# EAGLE design Attenuator (EAGLE 9.2.2)

## Sheet 1 of 4: Power
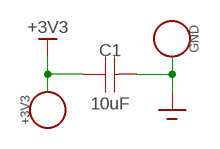
[diagram p0: schematic, sheet 1]

### Parts
C1  10uF  CAPACITOR0805  [0805]
TP1  +3V3  ALIGATOR-PAD  [ALIGATOR-PAD]
TP2  GND  ALIGATOR-PAD  [ALIGATOR-PAD]

### Nets
+3V3: C1.P$1 TP1.P$1 TP1.P$2 TP1.P$3 TP1.P$4 TP1.P$5 TP1.P$6 ; also sheet 2,3,4
GND: C1.P$2 TP2.P$1 TP2.P$2 TP2.P$3 TP2.P$4 TP2.P$5 TP2.P$6 ; also sheet 2,3,4

## Sheet 2 of 4: RF
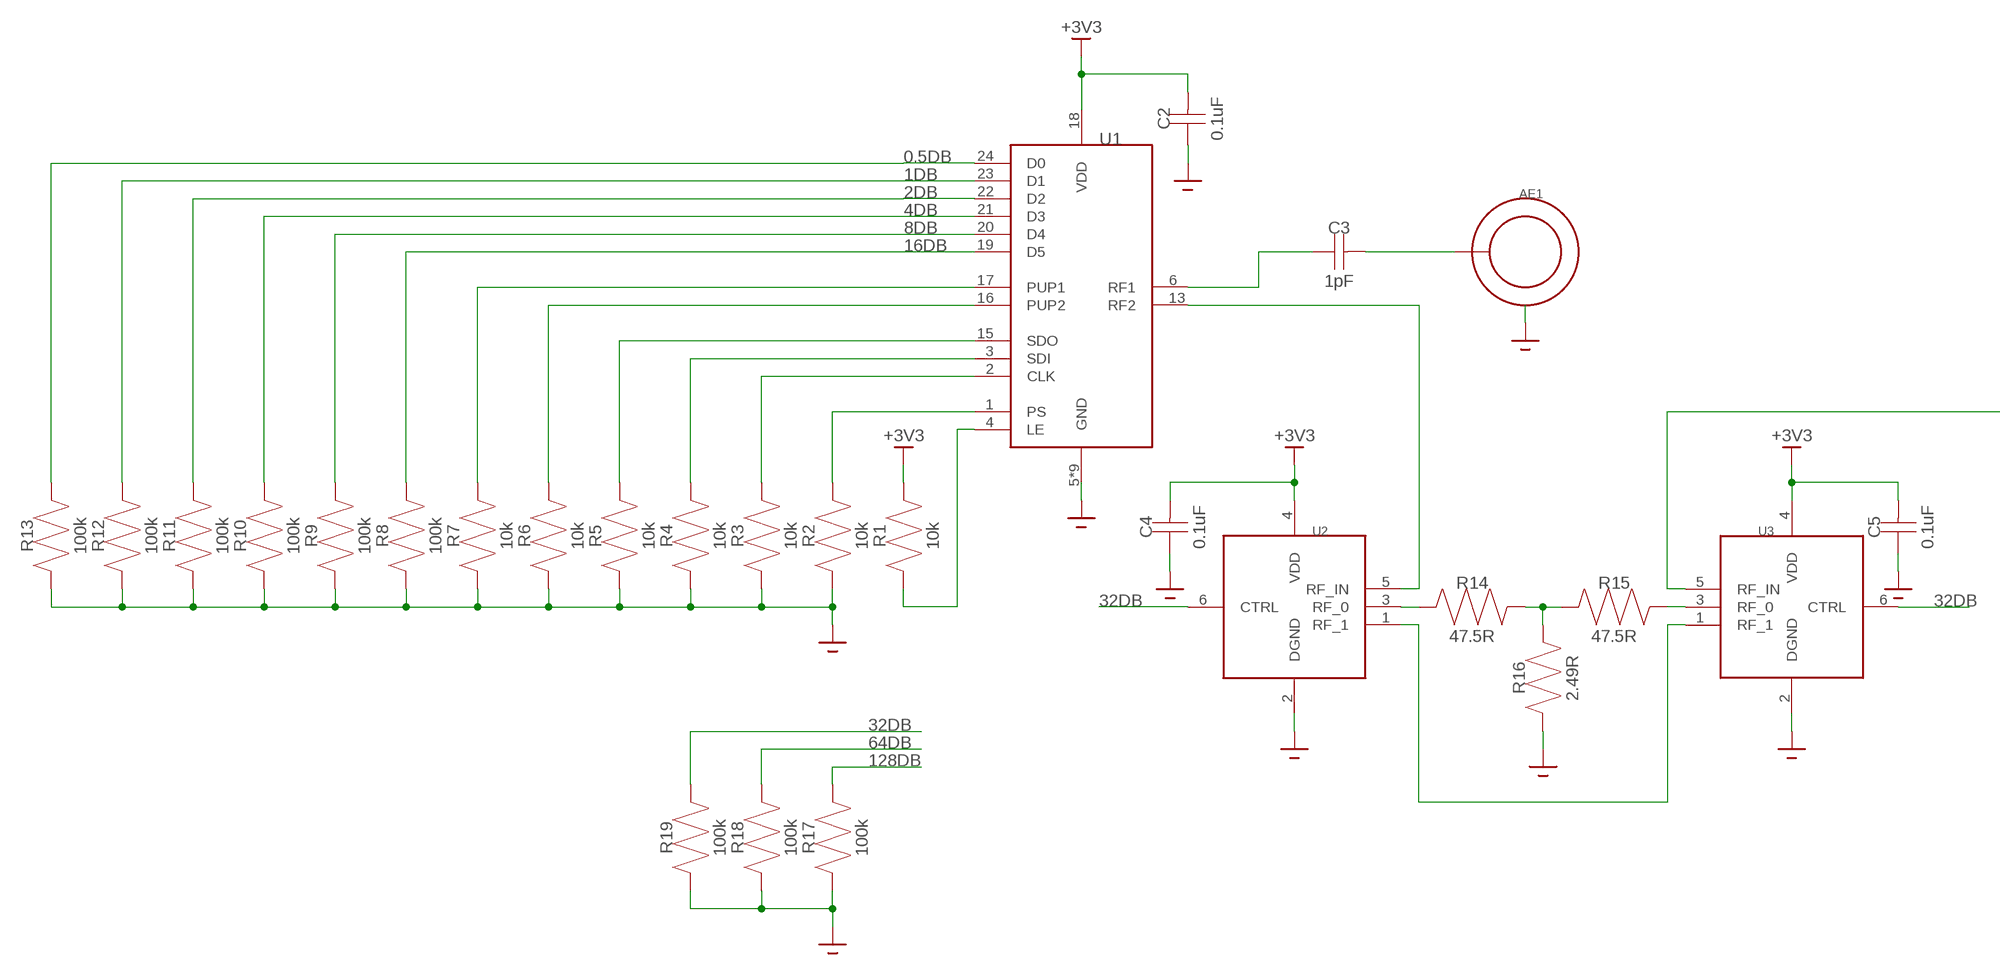
[diagram p1: schematic, sheet 2, part 1 of 2]
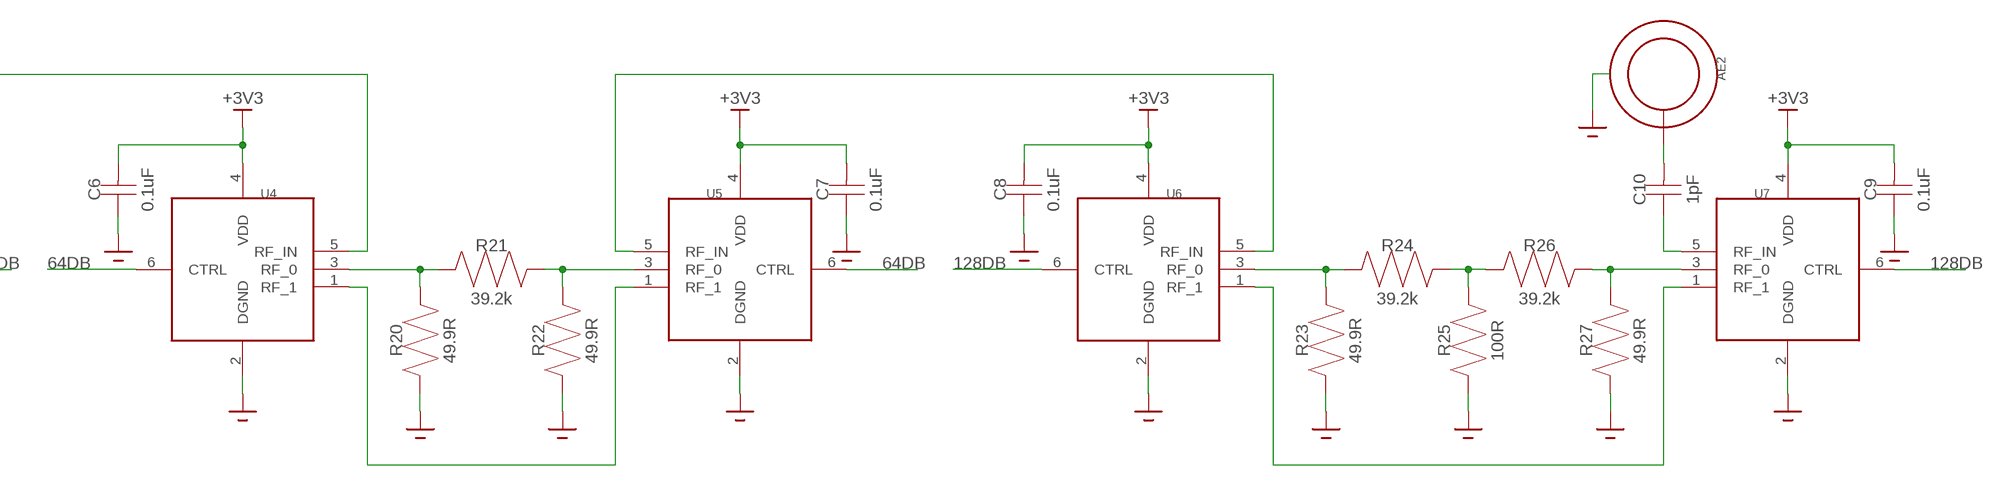
[diagram p2: schematic, sheet 2, part 2 of 2]

### Parts
AE1  CON-SMA-EDGE-S  [CON-SMA-EDGE-S]
AE2  CON-SMA-EDGE-S  [CON-SMA-EDGE-S]
C2  0.1uF  CAPACITOR0805  [0805]
C3  1pF  CAPACITOR0805  [0805]
C4  0.1uF  CAPACITOR0805  [0805]
C5  0.1uF  CAPACITOR0805  [0805]
C6  0.1uF  CAPACITOR0805  [0805]
C7  0.1uF  CAPACITOR0805  [0805]
C8  0.1uF  CAPACITOR0805  [0805]
C9  0.1uF  CAPACITOR0805  [0805]
C10  1pF  CAPACITOR0805  [0805]
R1  10k  RESISTOR0805  [0805]
R2  10k  RESISTOR0805  [0805]
R3  10k  RESISTOR0805  [0805]
R4  10k  RESISTOR0805  [0805]
R5  10k  RESISTOR0805  [0805]
R6  10k  RESISTOR0805  [0805]
R7  10k  RESISTOR0805  [0805]
R8  100k  RESISTOR0805  [0805]
R9  100k  RESISTOR0805  [0805]
R10  100k  RESISTOR0805  [0805]
R11  100k  RESISTOR0805  [0805]
R12  100k  RESISTOR0805  [0805]
R13  100k  RESISTOR0805  [0805]
R14  47.5R  RESISTOR0805  [0805]
R15  47.5R  RESISTOR0805  [0805]
R16  2.49R  RESISTOR0805  [0805]
R17  100k  RESISTOR0805  [0805]
R18  100k  RESISTOR0805  [0805]
R19  100k  RESISTOR0805  [0805]
R20  49.9R  RESISTOR0805  [0805]
R21  39.2k  RESISTOR0805  [0805]
R22  49.9R  RESISTOR0805  [0805]
R23  49.9R  RESISTOR0805  [0805]
R24  39.2k  RESISTOR0805  [0805]
R25  100R  RESISTOR0805  [0805]
R26  39.2k  RESISTOR0805  [0805]
R27  49.9R  RESISTOR0805  [0805]
U1  SKY12347-362LF  [QFN50P400X400X100-25T270N]
U2  BGS12SN6E6327XTSA1  [SON40P70X110X40-6N]
U3  BGS12SN6E6327XTSA1  [SON40P70X110X40-6N]
U4  BGS12SN6E6327XTSA1  [SON40P70X110X40-6N]
U5  BGS12SN6E6327XTSA1  [SON40P70X110X40-6N]
U6  BGS12SN6E6327XTSA1  [SON40P70X110X40-6N]
U7  BGS12SN6E6327XTSA1  [SON40P70X110X40-6N]

### Nets
0.5DB: R13.P$2 U1.24(D0) ; also sheet 3,4
1DB: R12.P$2 U1.23(D1) ; also sheet 3,4
2DB: R11.P$2 U1.22(D2) ; also sheet 3,4
4DB: R10.P$2 U1.21(D3) ; also sheet 3,4
8DB: R9.P$2 U1.20(D4) ; also sheet 3,4
16DB: R8.P$2 U1.19(D5) ; also sheet 3,4
32DB: R19.P$2 U2.6(CTRL) U3.6(CTRL) ; also sheet 3,4
64DB: R18.P$2 U4.6(CTRL) U5.6(CTRL) ; also sheet 3,4
128DB: R17.P$2 U6.6(CTRL) U7.6(CTRL) ; also sheet 3,4
+3V3: C2.P$2 C4.P$2 C5.P$2 C6.P$2 C7.P$2 C8.P$2 C9.P$2 R1.P$2 U1.18(VDD) U2.4(VDD) U3.4(VDD) U4.4(VDD) U5.4(VDD) U6.4(VDD) U7.4(VDD) ; also sheet 1,3,4
GND: AE1.GND1(GND) AE1.GND2(GND) AE1.GND3(GND) AE1.GND4(GND) AE2.GND1(GND) AE2.GND2(GND) AE2.GND3(GND) AE2.GND4(GND) C2.P$1 C4.P$1 C5.P$1 C6.P$1 C7.P$1 C8.P$1 C9.P$1 R2.P$1 R3.P$1 R4.P$1 R5.P$1 R6.P$1 R7.P$1 R8.P$1 R9.P$1 R10.P$1 R11.P$1 R12.P$1 R13.P$1 R16.P$1 R17.P$1 R18.P$1 R19.P$1 R20.P$1 R22.P$1 R23.P$1 R25.P$1 R27.P$1 U1.5(GND) U1.7(GND) U1.8(GND) U1.9(GND) U1.10(GND) U1.11(GND) U1.12(GND) U1.14(GND) U1.25(GND) U2.2(DGND) U3.2(DGND) U4.2(DGND) U5.2(DGND) U6.2(DGND) U7.2(DGND) ; also sheet 1,3,4
N$1: C3.P$1 U1.6(RF1)
N$2: AE1.CENTER(OUT) C3.P$2
N$3: R1.P$1 U1.4(LE)
N$4: R2.P$2 U1.1(PS)
N$5: R3.P$2 U1.2(CLK)
N$6: R4.P$2 U1.3(SDI)
N$7: R5.P$2 U1.15(SDO)
N$8: R6.P$2 U1.16(PUP2)
N$9: R7.P$2 U1.17(PUP1)
N$10: U1.13(RF2) U2.5(RF_IN)
N$11: R14.P$1 U2.3(RF_0)
N$12: R14.P$2 R15.P$1 R16.P$2
N$13: R15.P$2 U3.3(RF_0)
N$14: U2.1(RF_1) U3.1(RF_1)
N$15: U3.5(RF_IN) U4.5(RF_IN)
N$16: R20.P$2 R21.P$1 U4.3(RF_0)
N$17: R21.P$2 R22.P$2 U5.3(RF_0)
N$18: U4.1(RF_1) U5.1(RF_1)
N$19: U5.5(RF_IN) U6.5(RF_IN)
N$20: R23.P$2 R24.P$1 U6.3(RF_0)
N$21: R24.P$2 R25.P$2 R26.P$1
N$22: R26.P$2 R27.P$2 U7.3(RF_0)
N$23: U6.1(RF_1) U7.1(RF_1)
N$24: C10.P$1 U7.5(RF_IN)
N$25: AE2.CENTER(OUT) C10.P$2

## Sheet 3 of 4: MCU
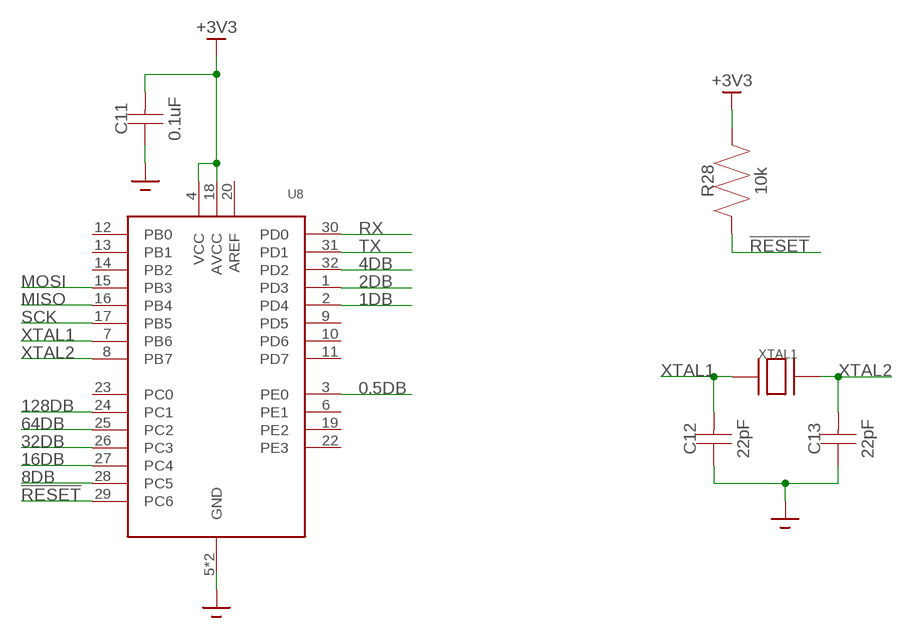
[diagram p3: schematic, sheet 3]

### Parts
C11  0.1uF  CAPACITOR0805  [0805]
C12  22pF  CAPACITOR0805  [0805]
C13  22pF  CAPACITOR0805  [0805]
R28  10k  RESISTOR0805  [0805]
U8  ATMEGA328PB32-TQFP  [QFP80P900X900X120-32]
XTAL1  CRYSTAL  [ABM2]

### Nets
0.5DB: U8.3(PE0) ; also sheet 2,4
1DB: U8.2(PD4) ; also sheet 2,4
2DB: U8.1(PD3) ; also sheet 2,4
4DB: U8.32(PD2) ; also sheet 2,4
8DB: U8.28(PC5) ; also sheet 2,4
16DB: U8.27(PC4) ; also sheet 2,4
32DB: U8.26(PC3) ; also sheet 2,4
64DB: U8.25(PC2) ; also sheet 2,4
128DB: U8.24(PC1) ; also sheet 2,4
!RESET: R28.P$1 U8.29(PC6) ; also sheet 4
+3V3: C11.P$2 R28.P$2 U8.4(VCC) U8.18(AVCC) ; also sheet 1,2,4
GND: C11.P$1 C12.P$1 C13.P$1 U8.5(GND) U8.21(GND) ; also sheet 1,2,4
MISO: U8.16(PB4) ; also sheet 4
MOSI: U8.15(PB3) ; also sheet 4
RX: U8.30(PD0) ; also sheet 4
SCK: U8.17(PB5) ; also sheet 4
TX: U8.31(PD1) ; also sheet 4
XTAL1: C12.P$2 U8.7(PB6) XTAL1.P$1
XTAL2: C13.P$2 U8.8(PB7) XTAL1.P$2
Unconnected: U8.6(PE1) U8.9(PD5) U8.10(PD6) U8.11(PD7) U8.12(PB0) U8.13(PB1) U8.14(PB2) U8.19(PE2) U8.22(PE3) U8.23(PC0)

## Sheet 4 of 4: Interface
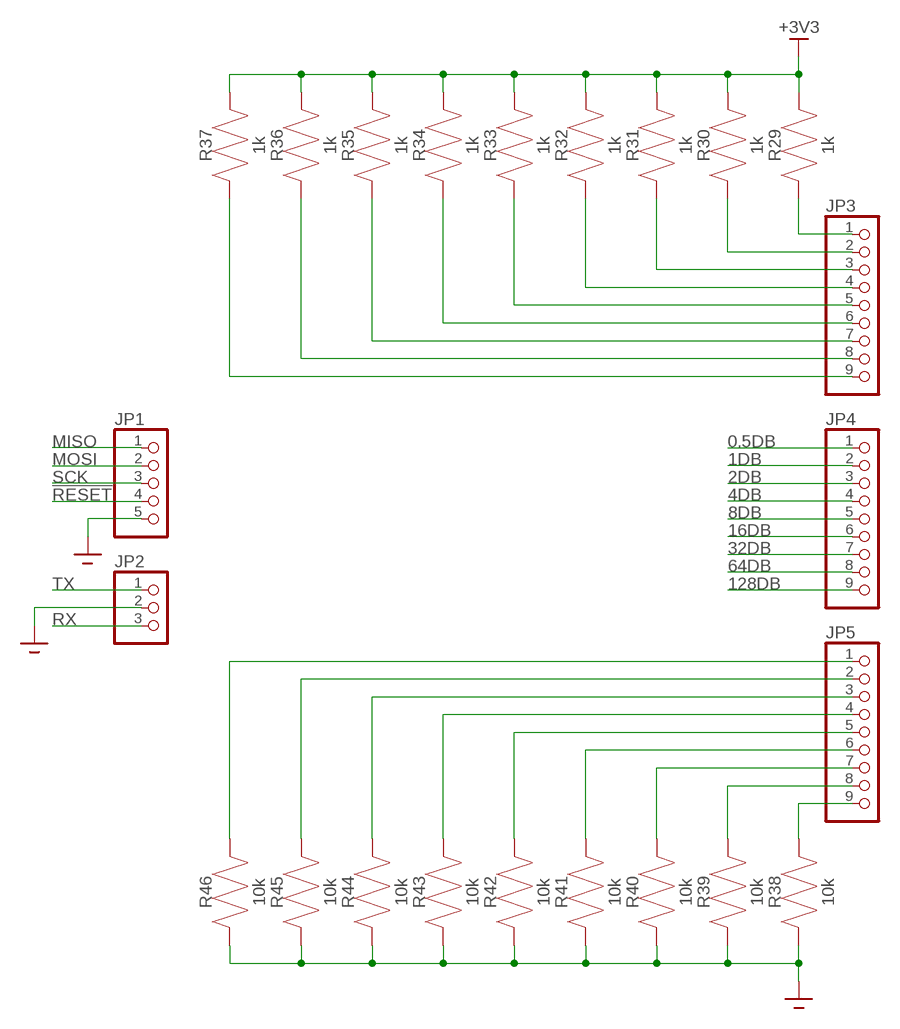
[diagram p4: schematic, sheet 4]

### Parts
JP1  PINHD-1X5  [1X05]
JP2  PINHD-1X3  [1X03]
JP3  PINHD-1X9  [1X09]
JP4  PINHD-1X9  [1X09]
JP5  PINHD-1X9  [1X09]
R29  1k  RESISTOR0805  [0805]
R30  1k  RESISTOR0805  [0805]
R31  1k  RESISTOR0805  [0805]
R32  1k  RESISTOR0805  [0805]
R33  1k  RESISTOR0805  [0805]
R34  1k  RESISTOR0805  [0805]
R35  1k  RESISTOR0805  [0805]
R36  1k  RESISTOR0805  [0805]
R37  1k  RESISTOR0805  [0805]
R38  10k  RESISTOR0805  [0805]
R39  10k  RESISTOR0805  [0805]
R40  10k  RESISTOR0805  [0805]
R41  10k  RESISTOR0805  [0805]
R42  10k  RESISTOR0805  [0805]
R43  10k  RESISTOR0805  [0805]
R44  10k  RESISTOR0805  [0805]
R45  10k  RESISTOR0805  [0805]
R46  10k  RESISTOR0805  [0805]

### Nets
0.5DB: JP4.1 ; also sheet 2,3
1DB: JP4.2 ; also sheet 2,3
2DB: JP4.3 ; also sheet 2,3
4DB: JP4.4 ; also sheet 2,3
8DB: JP4.5 ; also sheet 2,3
16DB: JP4.6 ; also sheet 2,3
32DB: JP4.7 ; also sheet 2,3
64DB: JP4.8 ; also sheet 2,3
128DB: JP4.9 ; also sheet 2,3
!RESET: JP1.4 ; also sheet 3
+3V3: R29.P$2 R30.P$2 R31.P$2 R32.P$2 R33.P$2 R34.P$2 R35.P$2 R36.P$2 R37.P$2 ; also sheet 1,2,3
GND: JP1.5 JP2.2 R38.P$1 R39.P$1 R40.P$1 R41.P$1 R42.P$1 R43.P$1 R44.P$1 R45.P$1 R46.P$1 ; also sheet 1,2,3
MISO: JP1.1 ; also sheet 3
MOSI: JP1.2 ; also sheet 3
N$26: JP3.1 R29.P$1
N$27: JP3.2 R30.P$1
N$28: JP3.3 R31.P$1
N$29: JP3.4 R32.P$1
N$30: JP3.5 R33.P$1
N$31: JP3.6 R34.P$1
N$32: JP3.7 R35.P$1
N$33: JP3.8 R36.P$1
N$34: JP3.9 R37.P$1
N$36: JP5.9 R38.P$2
N$37: JP5.8 R39.P$2
N$38: JP5.7 R40.P$2
N$39: JP5.6 R41.P$2
N$40: JP5.5 R42.P$2
N$41: JP5.4 R43.P$2
N$42: JP5.3 R44.P$2
N$43: JP5.2 R45.P$2
N$44: JP5.1 R46.P$2
RX: JP2.3 ; also sheet 3
SCK: JP1.3 ; also sheet 3
TX: JP2.1 ; also sheet 3

## Power pins joined to a net without a drawn wire
AREF: U8.20(AREF)

## Library data of the parts
AE1 AE2 = Attenuator:CON-SMA-EDGE-S
C1-C13 = Attenuator:CAPACITOR
JP1 = Attenuator:PINHD-1X5: PIN HEADER
JP2 = Attenuator:PINHD-1X3: PIN HEADER
JP3-JP5 = Attenuator:PINHD-1X9: PIN HEADER
R1-R46 = Attenuator:RESISTOR
TP1 TP2 = Attenuator:ALIGATOR-PAD
U1 = Attenuator:SKY12347-362LF
U2-U7 = Attenuator:BGS12SN6E6327XTSA1
U8 = Attenuator:ATMEGA328PB
XTAL1 = Attenuator:CRYSTAL

## Board
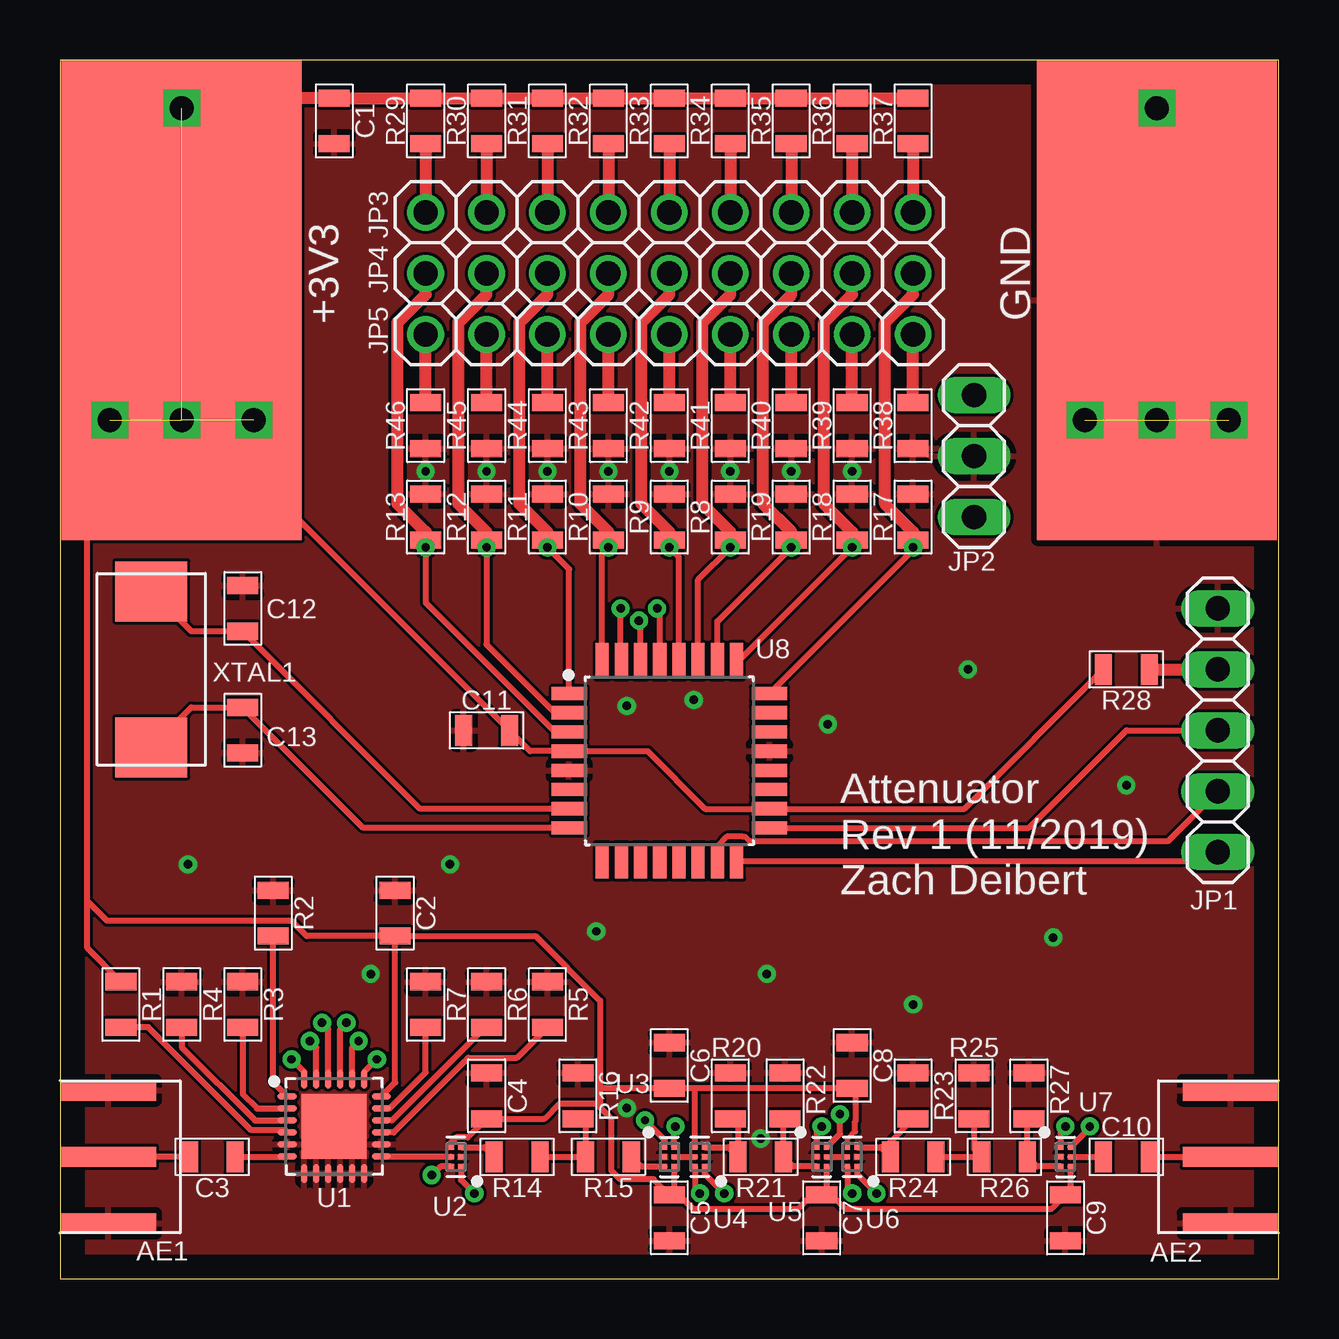
[diagram p5: board, top side]
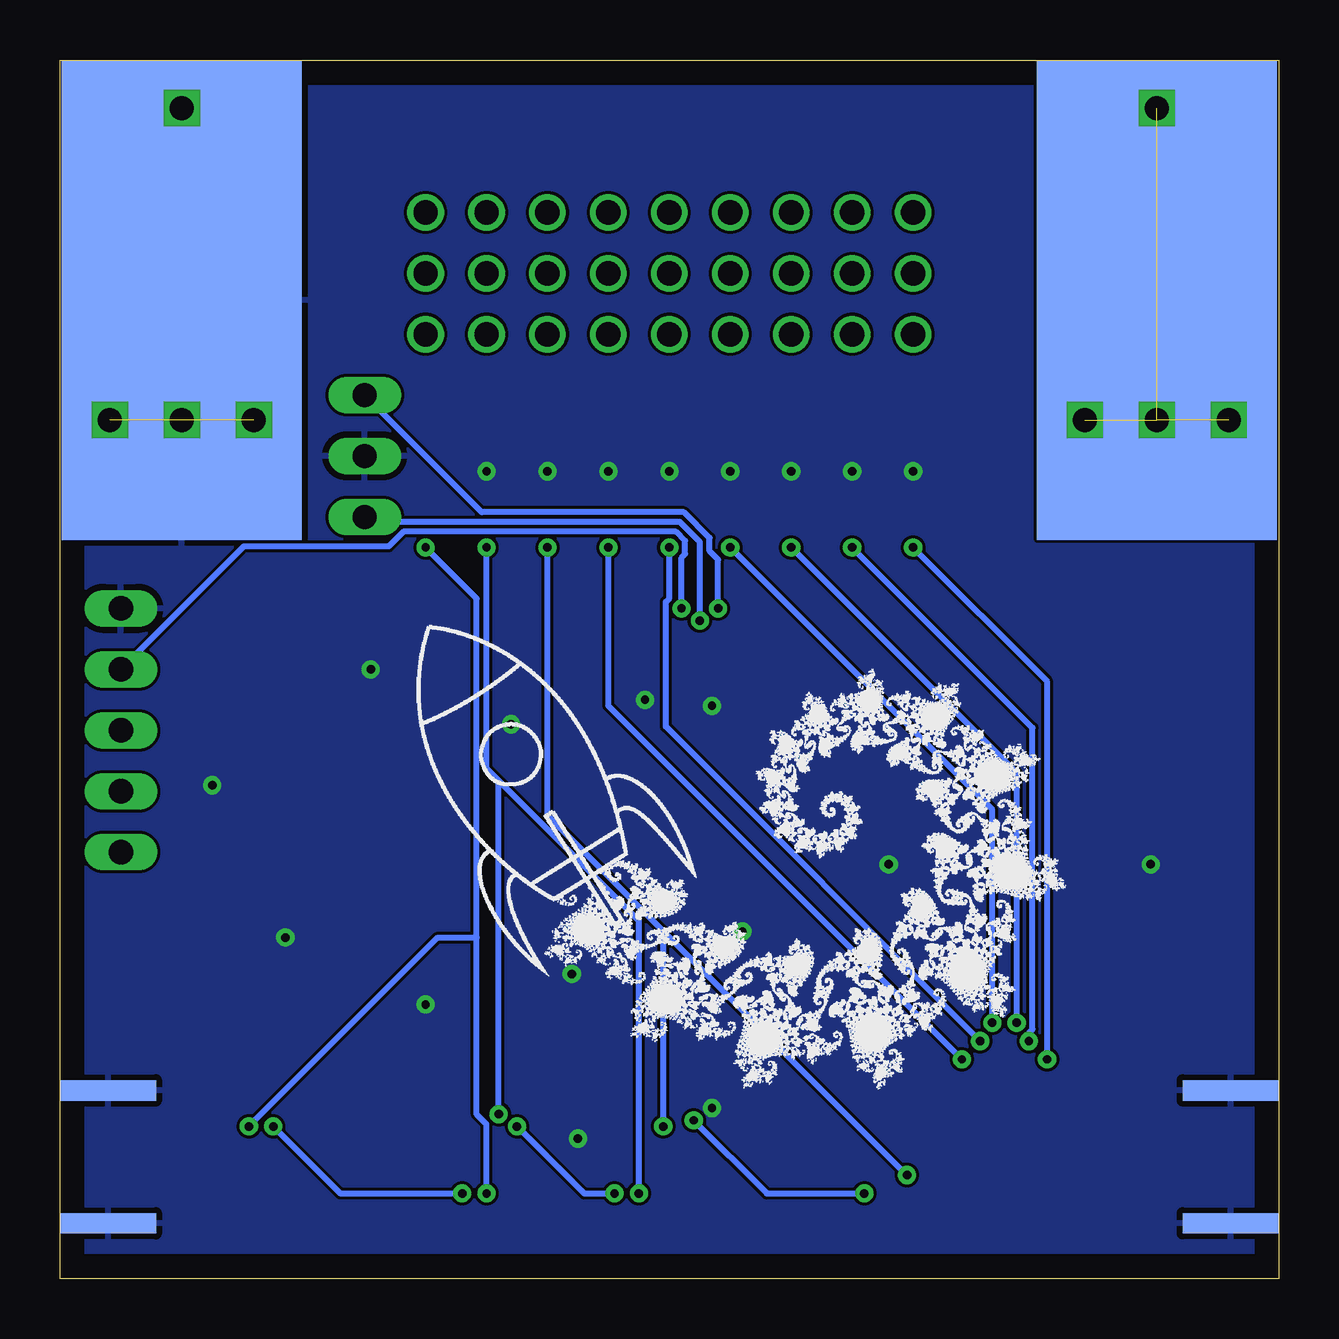
[diagram p6: board, bottom side, seen from below]

Size 50.8 x 50.8 mm. Coordinates in mm from the lower left corner, seen from the top.
Outline: 0,0 50.8,0 50.8,50.8 0,50.8 0,0
Copper layers (1*16): Top 0.035mm / dielectric 1.5mm / Bottom 0.035mm
Design rules "default *": minimum track width 6mil, minimum drill 0.35mm, track to track 5mil, track to pad 5mil, pad to pad 5mil, via to via 5mil, smd to smd 5mil, copper to edge 40mil, drill to drill 6mil, minimum pad ring 10mil, minimum via ring 8mil, stop-mask expansion 4mil, vias tented up to drill 0mil, thermal gap 10mil

### Footprints (pad centres in the part's own frame; a part is rotated, then mirrored left to right if it is on the bottom)
CON-SMA-EDGE-S = smd 4 x 0.85: CENTER -2,0; GND1 -2,2.77; GND2 -2,-2.77 | smd 4 x 0.85 bottom: GND3 -2,2.77; GND4 -2,-2.77
0805 = smd 0.711 x 1.295: P$1 -0.953,0; P$2 0.953,0
1X05 = drill 1.016 long: 1 -5.08,0; 2 -2.54,0; 3 0,0; 4 2.54,0; 5 5.08,0
1X03 = drill 1.016 long: 1 -2.54,0; 2 0,0; 3 2.54,0
1X09 = drill 1.016: 1 -10.16,0; 2 -7.62,0; 3 -5.08,0; 4 -2.54,0; 5 0,0; 6 2.54,0; 7 5.08,0; 8 7.62,0; 9 10.16,0
ALIGATOR-PAD = smd 20 x 10: P$1 -10,0 | smd 20 x 10 bottom: P$2 -10,0 | drill 1 square: P$3 -15,0; P$4 -15,3; P$5 -15,-3; P$6 -2,0
QFN50P400X400X100-25T270N = smd 0.787 x 0.264: 1 -1.962,1.25; 2 -1.962,0.75; 3 -1.962,0.25; 4 -1.962,-0.25; 5 -1.962,-0.75; 6 -1.962,-1.25; 13 1.962,-1.25; 14 1.962,-0.75; 15 1.962,-0.25; 16 1.962,0.25; 17 1.962,0.75; 18 1.962,1.25 | smd 0.264 x 0.787: 7 -1.25,-1.962; 8 -0.75,-1.962; 9 -0.25,-1.962; 10 0.25,-1.962; 11 0.75,-1.962; 12 1.25,-1.962; 19 1.25,1.962; 20 0.75,1.962; 21 0.25,1.962; 22 -0.25,1.962; 23 -0.75,1.962; 24 -1.25,1.962 | smd 2.7 x 2.7: 25 0,0
SON40P70X110X40-6N = smd 0.22 x 0.22: 1 -0.2,0.4; 2 -0.2,0; 3 -0.2,-0.4; 4 0.2,-0.4; 5 0.2,0; 6 0.2,0.4
QFP80P900X900X120-32 = smd 1.469 x 0.547: 1 -4.171,2.8; 2 -4.171,2; 3 -4.171,1.2; 4 -4.171,0.4; 5 -4.171,-0.4; 6 -4.171,-1.2; 7 -4.171,-2; 8 -4.171,-2.8; 17 4.171,-2.8; 18 4.171,-2; 19 4.171,-1.2; 20 4.171,-0.4; 21 4.171,0.4; 22 4.171,1.2; 23 4.171,2; 24 4.171,2.8 | smd 0.547 x 1.469: 9 -2.8,-4.171; 10 -2,-4.171; 11 -1.2,-4.171; 12 -0.4,-4.171; 13 0.4,-4.171; 14 1.2,-4.171; 15 2,-4.171; 16 2.8,-4.171; 25 2.8,4.171; 26 2,4.171; 27 1.2,4.171; 28 0.4,4.171; 29 -0.4,4.171; 30 -1.2,4.171; 31 -2,4.171; 32 -2.8,4.171
ABM2 = smd 2.5 x 3: P$1 -3.25,0; P$2 3.25,0

### Placement (x,y rotation side)
AE1  0,5.08 180 top
AE2  50.8,5.08 0 top
C1  11.43,48.26 270 top
C2  13.97,15.24 270 top
C3  6.35,5.08 180 top
C4  17.78,7.62 270 top
C5  25.4,2.54 90 top
C6  25.4,8.89 270 top
C7  31.75,2.54 90 top
C8  33.02,8.89 270 top
C9  41.91,2.54 90 top
C10  44.45,5.08 0 top
C11  17.78,22.86 0 top
C12  7.62,27.94 270 top
C13  7.62,22.86 90 top
JP1  48.26,22.86 90 top
JP2  38.1,34.29 270 top
JP3  25.4,44.45 0 top
JP4  25.4,41.91 0 top
JP5  25.4,39.37 0 top
R1  2.54,11.43 90 top
R2  8.89,15.24 270 top
R3  7.62,11.43 270 top
R4  5.08,11.43 270 top
R5  20.32,11.43 270 top
R6  17.78,11.43 270 top
R7  15.24,11.43 270 top
R8  27.94,31.75 270 top
R9  25.4,31.75 270 top
R10  22.86,31.75 270 top
R11  20.32,31.75 270 top
R12  17.78,31.75 270 top
R13  15.24,31.75 270 top
R14  19.05,5.08 0 top
R15  22.86,5.08 0 top
R16  21.59,7.62 270 top
R17  35.56,31.75 270 top
R18  33.02,31.75 270 top
R19  30.48,31.75 270 top
R20  27.94,7.62 270 top
R21  29.21,5.08 0 top
R22  30.23,7.62 270 top
R23  35.56,7.62 270 top
R24  35.56,5.08 0 top
R25  38.1,7.62 270 top
R26  39.37,5.08 0 top
R27  40.39,7.62 270 top
R28  44.45,25.4 180 top
R29  15.24,48.26 90 top
R30  17.78,48.26 90 top
R31  20.32,48.26 90 top
R32  22.86,48.26 90 top
R33  25.4,48.26 90 top
R34  27.94,48.26 90 top
R35  30.48,48.26 90 top
R36  33.02,48.26 90 top
R37  35.56,48.26 90 top
R38  35.56,35.56 90 top
R39  33.02,35.56 90 top
R40  30.48,35.56 90 top
R41  27.94,35.56 90 top
R42  25.4,35.56 90 top
R43  22.86,35.56 90 top
R44  20.32,35.56 90 top
R45  17.78,35.56 90 top
R46  15.24,35.56 90 top
TP1  5.08,50.8 90 top
TP2  45.72,50.8 90 top
U1  11.43,6.35 0 top
U2  16.51,5.08 180 top
U3  25.4,5.08 0 top
U4  26.67,5.08 180 top
U5  31.75,5.08 0 top
U6  33.02,5.08 180 top
U7  41.91,5.08 0 top
U8  25.4,21.59 0 top
XTAL1  3.81,25.4 270 top

### Tracks (layer width: path | path; a pad name or v marks a point on that pad's centre or on a via)
0.5DB  (via drill 0.35)
  Top 0.254: v15.24,30.48 15.24,28.18 20.62,22.79 U8.3 | U1.24 10.18,8.62 v9.65,9.14
  Top 0.508: JP4.1 15.24,41.02 14.07,39.85 14.07,32.29 15.24,31.12 R13.P$2 v15.24,30.48
  Bottom 0.254: v9.65,9.14 9.65,24.89 v15.24,30.48
1DB  (via drill 0.35)
  Top 0.254: v17.78,30.48 17.78,26.43 20.62,23.59 U8.2 | U1.23 10.68,9.64 v10.41,9.91
  Top 0.508: JP4.2 17.78,41.02 16.61,39.85 16.61,32.29 17.78,31.12 R12.P$2 v17.78,30.48
  Bottom 0.254: v10.41,9.91 10.41,10.25 10.26,10.4 10.26,22.96 v17.78,30.48
2DB  (via drill 0.35)
  Top 0.254: U8.1 21.23,29.57 v20.32,30.48 | U1.22 11.18,10.41 v10.92,10.67
  Top 0.508: JP4.3 20.32,41.02 19.15,39.85 19.15,32.29 20.32,31.12 R11.P$2 v20.32,30.48
  Bottom 0.254: v10.92,10.67 10.92,21.08 v20.32,30.48
4DB  (via drill 0.35)
  Top 0.254: U8.32 22.6,30.22 v22.86,30.48 | U1.21 11.68,10.41 v11.94,10.67
  Top 0.508: JP4.4 22.86,41.02 21.69,39.85 21.69,32.29 22.86,31.12 R10.P$2 v22.86,30.48
  Bottom 0.254: v11.94,10.67 11.94,19.56 v22.86,30.48
8DB  (via drill 0.35)
  Top 0.254: U8.28 25.8,30.08 v25.4,30.48 | U1.20 12.18,9.64 v12.45,9.91
  Top 0.508: JP4.5 25.4,41.02 24.23,39.85 24.23,32.29 25.4,31.12 R9.P$2 v25.4,30.48
  Bottom 0.254: v25.4,30.48 25.4,28.36 25.55,28.21 25.55,23.01 v12.45,9.91
16DB  (via drill 0.35)
  Top 0.254: U8.27 26.6,29.14 v27.94,30.48 | U1.19 12.68,8.62 v13.21,9.14
  Top 0.508: JP4.6 27.94,41.02 26.77,39.85 26.77,32.29 27.94,31.12 R8.P$2 v27.94,30.48
  Bottom 0.254: v13.21,9.14 27.94,23.88 v27.94,30.48
32DB  (via drill 0.35)
  Top 0.254: U8.26 27.4,27.4 v30.48,30.48 | v15.49,4.32 15.86,4.68 U2.6 | U3.6 25.6,6.3 v25.65,6.35
  Top 0.508: JP4.7 30.48,41.02 29.31,39.85 29.31,32.29 30.48,31.12 R19.P$2 v30.48,30.48
  Bottom 0.254: v15.49,4.32 25.65,14.48 | 25.65,14.48 30.48,19.3 v30.48,30.48 | v25.65,6.35 25.65,14.48
64DB  (via drill 0.35)
  Top 0.254: U8.25 28.3,25.76 v33.02,30.48 | U4.6 26.47,3.76 v26.67,3.56 | U5.6 32.51,6.04 v32.51,6.86
  Top 0.508: JP4.8 33.02,41.02 31.85,39.85 31.85,32.29 33.02,31.12 R18.P$2 v33.02,30.48
  Bottom 0.254: v26.67,3.56 26.67,14.92 32.51,20.76 | v33.02,30.48 33.02,21.27 32.51,20.76 | v32.51,6.86 32.51,20.76
128DB  (via drill 0.35)
  Top 0.254: U8.24 35.56,30.38 v35.56,30.48 | U6.6 32.82,3.76 v33.02,3.56 | U7.6 42.93,6.3 v42.93,6.35
  Top 0.508: JP4.9 35.56,41.02 34.39,39.85 34.39,32.29 35.56,31.12 R17.P$2 v35.56,30.48
  Bottom 0.254: v33.02,3.56 33.02,6.44 33.43,6.84 33.43,14.22 | v35.56,30.48 33.43,28.35 33.43,14.22 | v42.93,6.35 35.05,14.22 33.43,14.22
!RESET  (via drill 0.35)
  Top 0.254: U8.29 25,27.83 v24.89,27.94
  Top 0.508: R28.P$1 JP1.4
  Bottom 0.254: v24.89,27.94 24.89,30.06 24.74,30.21 24.74,30.75 25.13,31.14 36.48,31.14 37.09,30.52 43.14,30.52 JP1.4
+3V3  (5 unrouted)
  Top 0.203: U6.4 32.82,5.81 33.14,6.13
  Top 0.254: U3.4 25.6,3.69 C5.P$2 | U5.4 31.95,3.69 C7.P$2 | 42.11,3.69 42.12,3.7 | R1.P$2 1.14,13.78 1.14,15.75 | TP1.P$4 1.14,34.86 1.14,15.75 | 22.52,7.14 22.35,7.3 20.83,7.3 20.19,6.67 C4.P$2 17,5.89 16.5,5.89 16.3,5.69 16.31,5.68 U2.4 | 22.52,7.14 22.99,6.67 22.99,4.51 23.34,4.15 24.74,4.15 C5.P$2 | TP1.P$5 8.08,33.51 C11.P$2 19.6,21.99 U8.4 24.49,21.99 26.89,19.59 U8.18 37.69,19.59 R28.P$2 | U1.18 13.97,8.18 C2.P$2 | C2.P$2 10.29,14.29 9.65,14.92 1.97,14.92 1.14,15.75 | C2.P$2 19.81,14.29 22.52,11.58 22.52,7.87 | 22.52,7.87 22.52,7.14 | C7.P$2 32.15,3.49 32.75,2.9 41.32,2.9 C9.P$2 42.11,3.69 | C7.P$2 31.35,3.49 30.75,2.9 26.4,2.9 25.8,3.49 C5.P$2 | 33.14,6.13 33.14,6.56 33.17,6.59 33.17,7.79 C8.P$2 26.42,7.94 | 26.42,7.94 C6.P$2 22.58,7.94 22.52,7.87 | U4.4 26.47,7.88 26.42,7.94 | U7.4 42.11,3.69
  Top 0.508: TP1.P$6 5.49,49.21 C1.P$1 R29.P$2 R30.P$2 R31.P$2 R32.P$2 R33.P$2 R34.P$2 R35.P$2 R36.P$2 R37.P$2
GND  (via drill 0.35)  (2 unrouted)
  other vias: 16.26,17.27 23.62,23.88 26.42,24.13 32,23.11 29.46,12.7 35.56,11.43 41.4,14.22 44.45,20.57 37.85,25.4 22.35,14.48 5.33,17.27 29.21,5.84 15.24,33.66 17.78,33.66 20.32,33.66 22.86,33.66 25.4,33.66 27.94,33.66 30.48,33.66 33.02,33.66 23.62,7.11 12.95,12.7
  pour Top: 0,50.8 50.8,50.8 50.8,0 0,0
  pour Bottom: 0,50.8 50.8,50.8 50.8,0 0,0
MISO
  Top 0.254: U8.16 47.9,17.42 JP1.1
MOSI
  Top 0.203: 28.75,18.24 28.56,18.43 28.45,18.43
  Top 0.254: 28.45,18.43 27.81,18.43 27.4,18.02 U8.15 | JP1.2 46.18,18.24 28.75,18.24
N$1
  Top 0.254: C3.P$1 9.45,5.08 U1.6
N$2
  Top 0.254: C3.P$2 AE1.CENTER
N$3
  Top 0.254: U1.4 9.38,6.19 7.97,6.19 3.68,10.48 R1.P$1
N$4
  Top 0.254: U1.1 8.89,8.18 R2.P$2
N$5
  Top 0.254: U1.2 8.21,7.1 7.62,7.69 R3.P$2
N$6
  Top 0.254: U1.3 8.13,6.6 5.08,9.65 R4.P$2
N$7
  Top 0.254: R5.P$2 19.05,9.21 17.02,9.21 16.86,9.05 16.85,9.04 13.91,6.1 U1.15
N$8
  Top 0.254: R6.P$2 17.71,10.48 13.83,6.6 U1.16
N$9
  Top 0.254: R7.P$2 15.24,8.6 13.74,7.1 U1.17
N$10
  Top 0.254: U1.13 16.07,5.1 16.08,5.09 16.3,5.09 U2.5
N$11
  Top 0.254: U2.3 17.7,5.48 R14.P$1
N$12
  Top 0.254: R14.P$2 R15.P$1 21.91,6.35 R16.P$2
N$13
  Top 0.254: R15.P$2 24.21,4.68 U3.3
N$14  (via drill 0.35)
  Top 0.254: U2.1 16.71,4.12 v17.27,3.56 | U3.1 25.2,5.79 v24.38,6.6
  Bottom 0.254: v24.38,6.6 21.34,3.56 v17.27,3.56
N$15
  Top 0.254: U3.5 U4.5
N$16
  Top 0.254: U4.3 27.86,5.48 R21.P$1 28.26,6.35 R20.P$2
N$17
  Top 0.254: R22.P$2 30.16,6.6 R21.P$2 30.56,4.68 U5.3
N$18  (via drill 0.35)
  Top 0.254: U4.1 26.87,4.37 v27.69,3.56 | U5.1 31.55,6.15 v31.75,6.35
  Bottom 0.254: v31.75,6.35 28.96,3.56 v27.69,3.56
N$19
  Top 0.254: U5.5 U6.5
N$20
  Top 0.254: U6.3 34.21,5.48 R24.P$1 34.61,5.71 R23.P$2
N$21
  Top 0.254: R24.P$2 R26.P$1 38.1,5.4 R25.P$2
N$22
  Top 0.254: R27.P$2 40.32,6.6 R26.P$2 40.72,4.68 U7.3
N$23  (via drill 0.35)
  Top 0.254: U6.1 33.22,4.37 v34.04,3.56 | U7.1 41.71,6.15 v41.91,6.35
  Bottom 0.254: v41.91,6.35 39.12,3.56 v34.04,3.56
N$24
  Top 0.254: U7.5 C10.P$1
N$25
  Top 0.254: C10.P$2 AE2.CENTER
N$26
  Top 0.508: R29.P$1 JP3.1
N$27
  Top 0.508: R30.P$1 JP3.2
N$28
  Top 0.508: R31.P$1 JP3.3
N$29
  Top 0.508: R32.P$1 JP3.4
N$30
  Top 0.508: R33.P$1 JP3.5
N$31
  Top 0.508: R34.P$1 JP3.6
N$32
  Top 0.508: R35.P$1 JP3.7
N$33
  Top 0.508: R36.P$1 JP3.8
N$34
  Top 0.508: R37.P$1 JP3.9
N$36
  Top 0.508: R38.P$2 JP5.9
N$37
  Top 0.508: R39.P$2 JP5.8
N$38
  Top 0.508: R40.P$2 JP5.7
N$39
  Top 0.508: R41.P$2 JP5.6
N$40
  Top 0.508: R42.P$2 JP5.5
N$41
  Top 0.508: R43.P$2 JP5.4
N$42
  Top 0.508: R44.P$2 JP5.3
N$43
  Top 0.508: R45.P$2 JP5.2
N$44
  Top 0.508: R46.P$2 JP5.1
RX  (via drill 0.35)
  Top 0.254: U8.30 24.2,27.36 v24.13,27.43
  Bottom 0.254: v24.13,27.43 24.13,30.71 24.96,31.54 37.89,31.54 JP2.3
SCK
  Top 0.254: U8.17 40.38,18.79 44.45,22.86 JP1.3
TX  (via drill 0.35)
  Top 0.254: U8.31 23.37,25.79 v23.37,27.94
  Bottom 0.254: v23.37,27.94 23.37,29.97 23.72,30.33 23.72,30.88 24.79,31.95 33.22,31.95 JP2.1
XTAL1
  Top 0.254: XTAL1.P$1 5.47,26.99 C12.P$2 15.02,19.59 U8.7
XTAL2
  Top 0.254: XTAL1.P$2 5.47,23.81 C13.P$2 12.64,18.79 U8.8

### Text on the board
tNames: Attenuator / Rev 1 (11/2019) / Zach Deibert